# EAGLE design chariot_power (EAGLE 9.2.2)
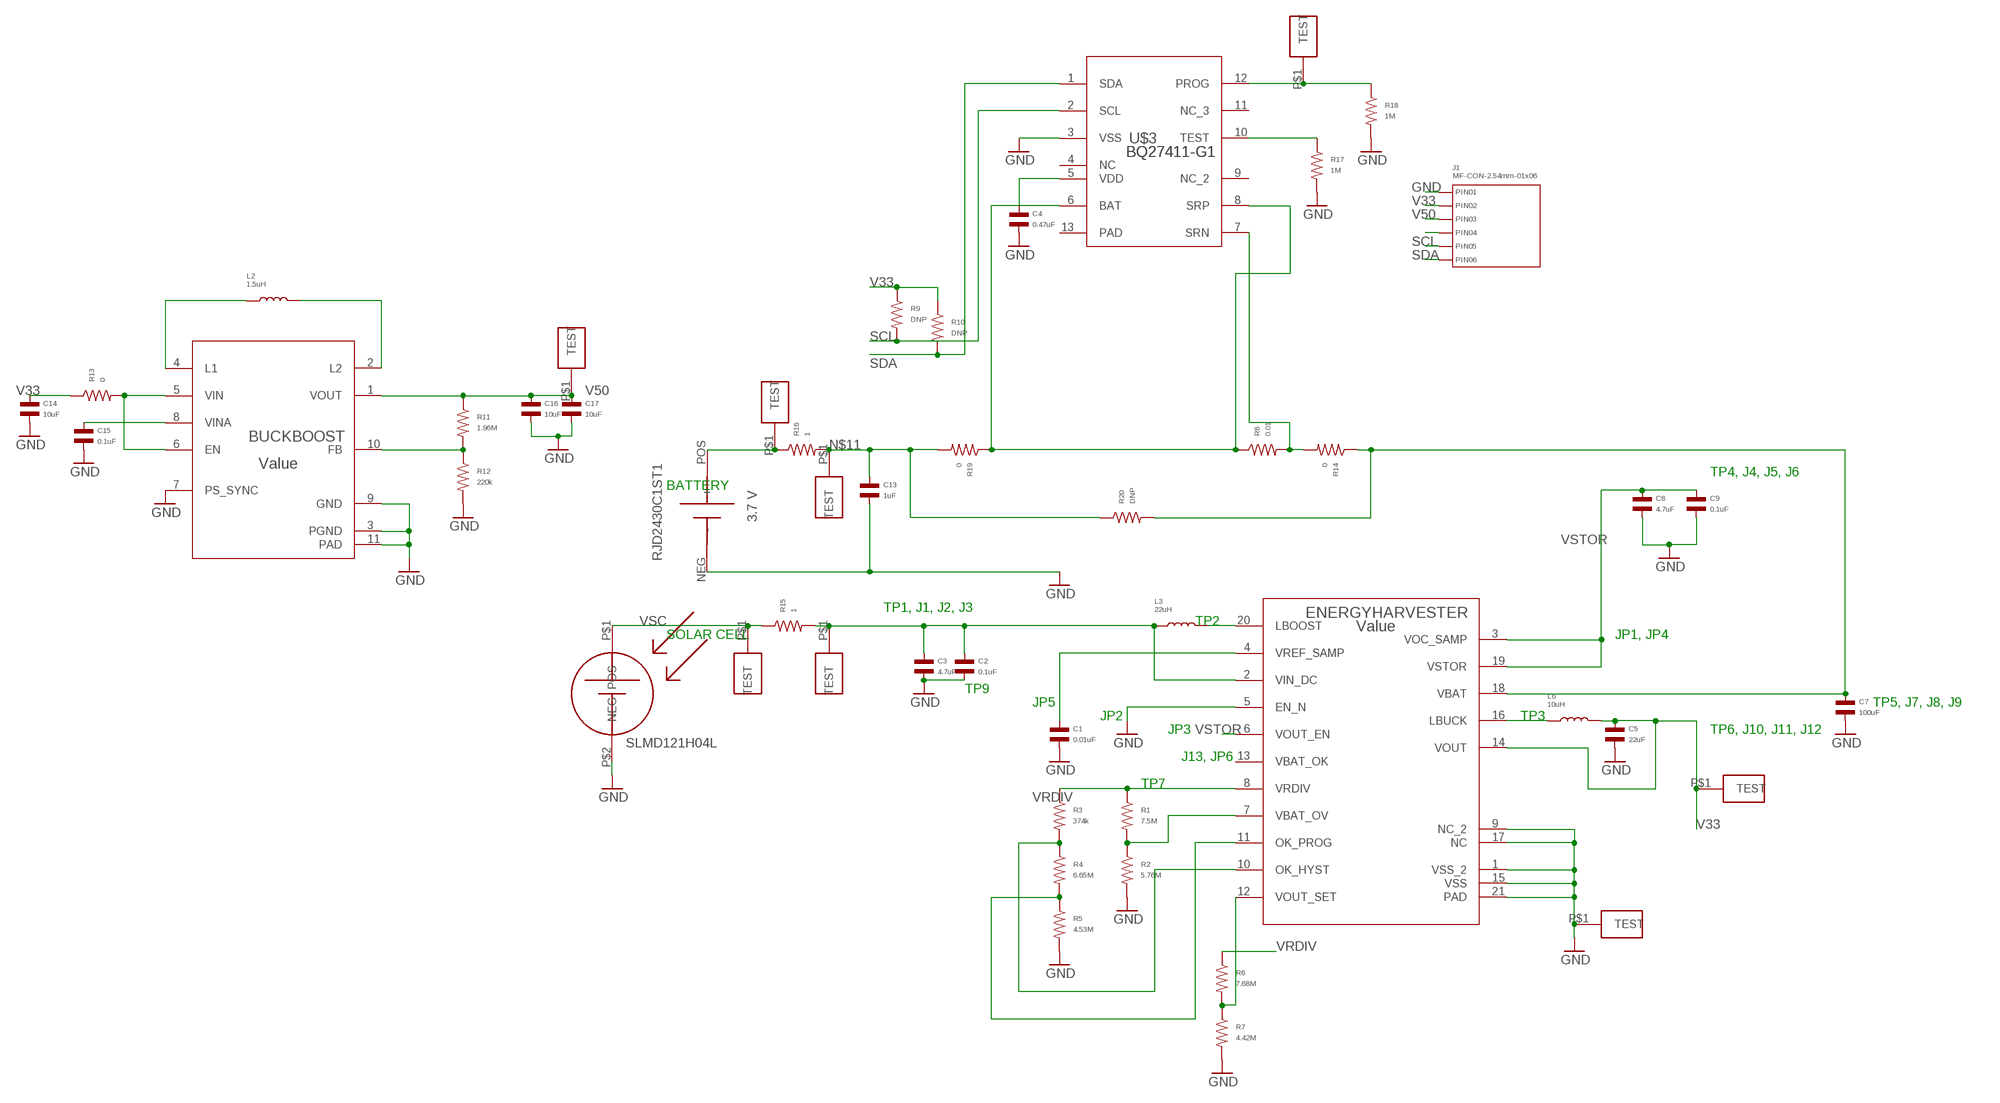
[diagram p0: schematic, sheet 1]

## Parts
BUCKBOOST  Value  TPS63030DSKR  [DSK0010A]
C1  0.01uF  CAPACITOR_NP_0603  [C0603]
C2  0.1uF  CAPACITOR_NP_0603  [C0603]
C3  4.7uF  CAPACITOR_NP_0603  [C0603]
C4  0.47uF  CAPACITOR_NP_0603  [C0603]
C5  22uF  CAPACITOR_NP_0603  [C0603]
C7  100uF  CAPACITOR_NP_0603  [C0603]
C8  4.7uF  CAPACITOR_NP_0603  [C0603]
C9  0.1uF  CAPACITOR_NP_0603  [C0603]
C13  1uF  CAPACITOR_NP_0603  [C0603]
C14  10uF  CAPACITOR_NP_0603  [C0603]
C15  0.1uF  CAPACITOR_NP_0603  [C0603]
C16  10uF  CAPACITOR_NP_0603  [C0603]
C17  10uF  CAPACITOR_NP_0603  [C0603]
ENERGYHARVESTER  Value  BQ25570RGRR  [RGR0020A]
J1  MF-CON-2.54mm-01x06  CON_01X06_PTH_2.54MM  [PTH_2.54MM_01X06]
L2  1.5uH  INDUCTOR_0603  [L0603]
L3  22uH  INDUCTOR_0603  [L0603]
L6  10uH  INDUCTOR_0603  [L0603]
R1  7.5M  RESISTOR_0603  [R0603]
R2  5.76M  RESISTOR_0603  [R0603]
R3  374k  RESISTOR_0603  [R0603]
R4  6.65M  RESISTOR_0603  [R0603]
R5  4.53M  RESISTOR_0603  [R0603]
R6  7.68M  RESISTOR_0603  [R0603]
R7  4.42M  RESISTOR_0603  [R0603]
R8  0.01  RESISTOR_0603  [R0603]
R9  DNP  RESISTOR_0603  [R0603]
R10  DNP  RESISTOR_0603  [R0603]
R11  1.96M  RESISTOR_0603  [R0603]
R12  220k  RESISTOR_0603  [R0603]
R13  0  RESISTOR_0603  [R0603]
R14  0  RESISTOR_0603  [R0603]
R15  1  RESISTOR_0603  [R0603]
R16  1  RESISTOR_0603  [R0603]
R17  1M  RESISTOR_0603  [R0603]
R18  1M  RESISTOR_0603  [R0603]
R19  0  RESISTOR_0603  [R0603]
R20  DNP  RESISTOR_0603  [R0603]
TP1  TESTPOINT_LOOP  [TESTPOINT_LOOP]
TP2  TESTPOINT_LOOP  [TESTPOINT_LOOP]
TP3  TESTPOINT_LOOP  [TESTPOINT_LOOP]
TP4  TESTPOINT_LOOP  [TESTPOINT_LOOP]
TP5  TESTPOINT_LOOP  [TESTPOINT_LOOP]
TP6  TESTPOINT_LOOP  [TESTPOINT_LOOP]
TP7  TESTPOINT_LOOP  [TESTPOINT_LOOP]
TP8  TESTPOINT_LOOP  [TESTPOINT_LOOP]
U$1  SLMD121H04L  [SLMD121H04L]
U$2  RJD2430C1ST1.  [RJD2430C1ST1]
U$3  BQ27411-G1  [DRZ0012A]

## Nets
EXT_VCC: J1.P$4(PIN4)
GND: BUCKBOOST.3(PGND) BUCKBOOST.7(PS_SYNC) BUCKBOOST.9(GND) BUCKBOOST.11(PAD) C1.P$2 C2.P$2 C3.P$2 C4.P$2 C5.P$2 C7.P$2 C8.P$2 C9.P$2 C13.P$2 C14.P$2 C15.P$2 C16.P$2 C17.P$2 ENERGYHARVESTER.1(VSS_2) ENERGYHARVESTER.5(EN_N) ENERGYHARVESTER.9(NC_2) ENERGYHARVESTER.15(VSS) ENERGYHARVESTER.17(NC) ENERGYHARVESTER.21(PAD) J1.P$1(PIN1) R2.P$2 R5.P$2 R7.P$2 R12.P$2 R17.P$2 R18.P$2 TP1.P$1(TEST) U$1.P$2(NEG) U$2.NEG(-) U$3.3(VSS)
N$1: C1.P$1 ENERGYHARVESTER.4(VREF_SAMP)
N$2: ENERGYHARVESTER.20(LBOOST) L3.P$2
N$3: C7.P$1 ENERGYHARVESTER.18(VBAT) R14.P$1 R20.P$2
N$4: ENERGYHARVESTER.16(LBUCK) L6.P$1
N$5: C14.P$1 R13.P$1
N$6: ENERGYHARVESTER.7(VBAT_OV) R1.P$2 R2.P$1
N$7: ENERGYHARVESTER.12(VOUT_SET) R6.P$2 R7.P$1
N$8: R17.P$1 U$3.10(TEST)
N$9: ENERGYHARVESTER.10(OK_HYST) R3.P$2 R4.P$1
N$10: ENERGYHARVESTER.11(OK_PROG) R4.P$2 R5.P$1
N$11: C13.P$1 R16.P$2 R19.P$2 R20.P$1 TP7.P$1(TEST)
N$12: BUCKBOOST.4(L1) L2.P$1
N$13: R8.P$2 R14.P$2 U$3.7(SRN)
N$14: R18.P$1 TP8.P$1(TEST) U$3.12(PROG)
N$15: C4.P$1 U$3.5(VDD)
N$16: BUCKBOOST.2(L2) L2.P$2
N$18: BUCKBOOST.8(VINA) C15.P$1
N$20: BUCKBOOST.10(FB) R11.P$2 R12.P$1
SCL: J1.P$5(PIN5) R9.P$2 U$3.2(SCL)
SDA: J1.P$6(PIN6) R10.P$2 U$3.1(SDA)
V33: BUCKBOOST.5(VIN) BUCKBOOST.6(EN) C5.P$1 ENERGYHARVESTER.14(VOUT) J1.P$2(PIN2) L6.P$2 R9.P$1 R10.P$1 R13.P$2 TP2.P$1(TEST)
V50: BUCKBOOST.1(VOUT) C16.P$1 C17.P$1 J1.P$3(PIN3) R11.P$1 TP3.P$1(TEST)
VBAT: R16.P$1 TP5.P$1(TEST) U$2.POS(+)
VBAT2: R8.P$1 R19.P$1 U$3.6(BAT) U$3.8(SRP)
VIN1: C2.P$1 C3.P$1 ENERGYHARVESTER.2(VIN_DC) L3.P$1 R15.P$2 TP6.P$1(TEST)
VRDIV: ENERGYHARVESTER.8(VRDIV) R1.P$1 R3.P$1 R6.P$1
VSC: R15.P$1 TP4.P$1(TEST) U$1.P$1(POS)
VSTOR: C8.P$1 C9.P$1 ENERGYHARVESTER.3(VOC_SAMP) ENERGYHARVESTER.6(VOUT_EN) ENERGYHARVESTER.19(VSTOR)
Unconnected: ENERGYHARVESTER.13(VBAT_OK) U$3.4(NC) U$3.9(NC_2) U$3.11(NC_3) U$3.13(PAD)

## Notes on the sheet
- TP4, J4, J5, J6
- BATTERY
- TP1, J1, J2, J3
- TP2
- SOLAR CELL | JP1, JP4
- TP9
- JP5 | TP5, J7, J8, J9
- JP2 | TP3
- JP3 | TP6, J10, J11, J12
- J13, JP6
- TP7

## Library data of the parts
BUCKBOOST = CharIoT:TPS63030DSKR; COMPTYPE: IC; MANUFACTURER: Texas Instruments; MOUNTTYPE: SMT; PACKAGEREFERENCE: DSK0010A; PARTNUMBER: TPS63030DSK; PIN_COUNT: 11; REFDES: RefDes; ROHS: Y; TYPE: TYPE
C1-C5 C7-C9 C13-C17 = MF_Passives:CAPACITOR_NP: Library: MF_Passives Description: Device for Non-Polarized Capacitors. Manufacture part number (MPN) can be added via Attributes. Check https://factory.macrofab.com/parts for the house parts list.; POPULATE: 1
ENERGYHARVESTER = CharIoT:BQ25570RGRR: EVM; ALTERNATEPARTNUMBER: BQ25570RGRT; APPLICATION_BUILDNUMBER: *; COMPTYPE: IC; MANUFACTURER: Texas Instruments; MOUNTTYPE: SMT; PACKAGEREFERENCE: RGR0020A; PARTNUMBER: BQ25570RGRR; PIN_COUNT: 21; REFDES: RefDes; ROHS: Y; TYPE: TYPE
J1 = MF_Connectors:CON_01X06: Library: MF_Connectors Description: Header Connector with 6 Positions and 01 Rows. Use the LABEL Attribute to label the pin on the schematic and PCB. You can remove the attributes on the PCB by using the SMASH function on the part and then deleting the text.; HOUSEPART: YES; MPN: MF-CON-2.54mm-01x06; POPULATE: 1; URL: https://factory.macrofab.com/part/MF-CON-2.54mm-01x06
L2 L3 L6 = MF_Passives:INDUCTOR: Library: MF_Passives Description: Device for Inductors. Manufacture part number (MPN) can be added via Attributes. Check https://factory.macrofab.com/parts for the house parts list.; POPULATE: 1
R1-R20 = MF_Passives:RESISTOR: Library: MF_Passives Description: Device for Resistors. Manufacture part number (MPN), Voltage, Tolerance, and Wattage Rating can be added via Attributes. Check https://factory.macrofab.com/parts for the house parts list.; POPULATE: 1
TP1-TP8 = CharIoT:TESTPOINT_LOOP
U$1 = CharIoT:SLMD121H04L: Solar Cell
U$2 = CharIoT:RJD2430C1ST1.: Battery
U$3 = CharIoT:BQ27411-G1: New Fuel Gauge

## Board
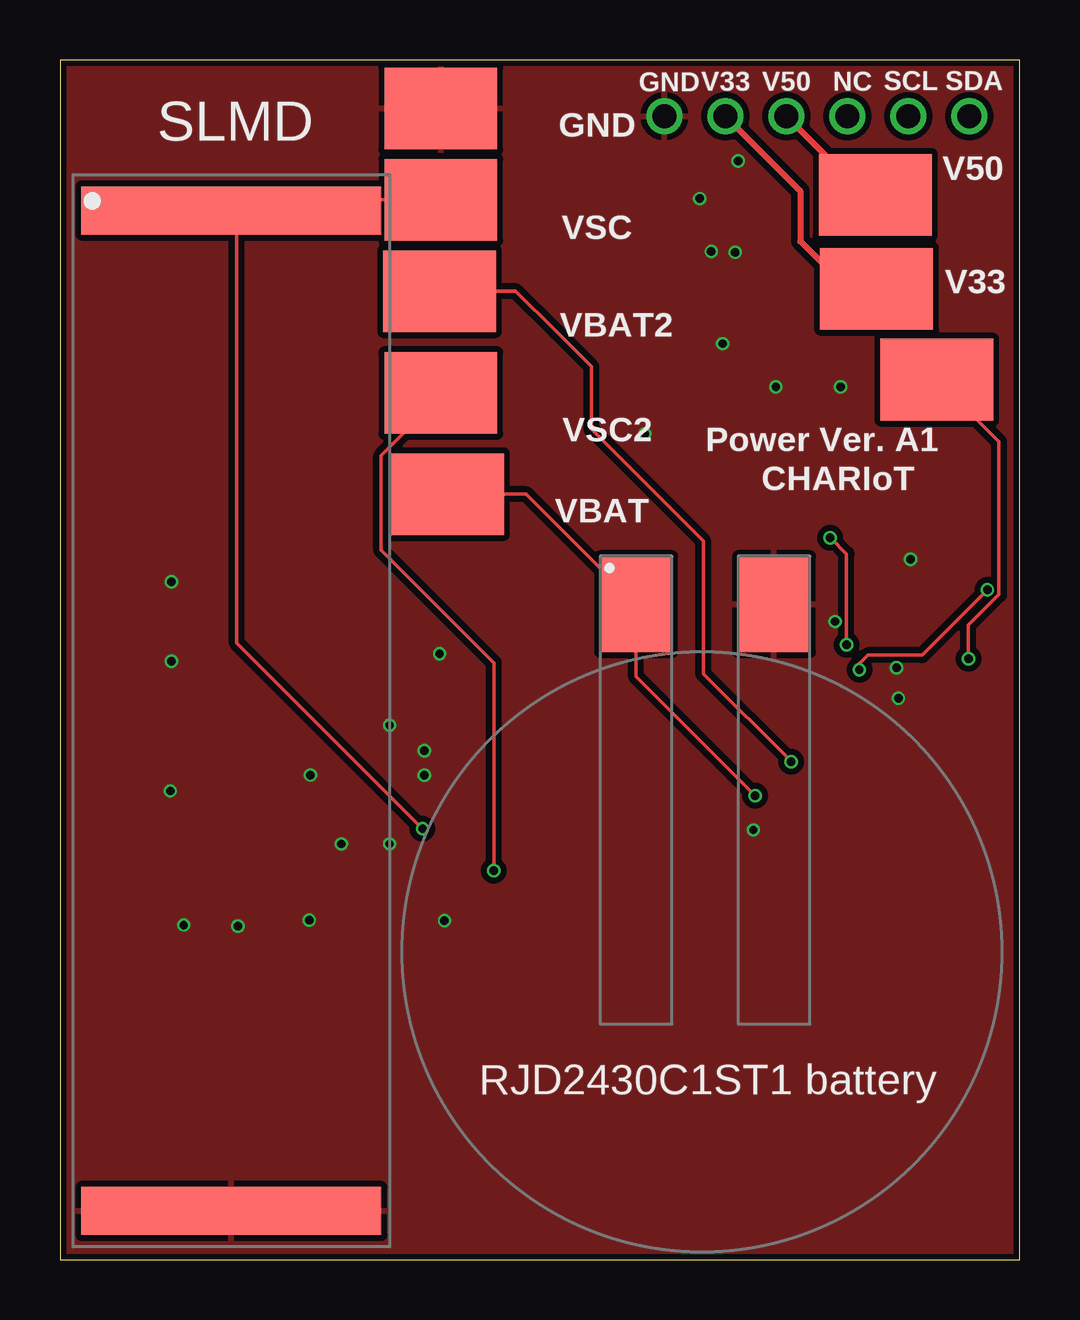
[diagram p1: board, top side]
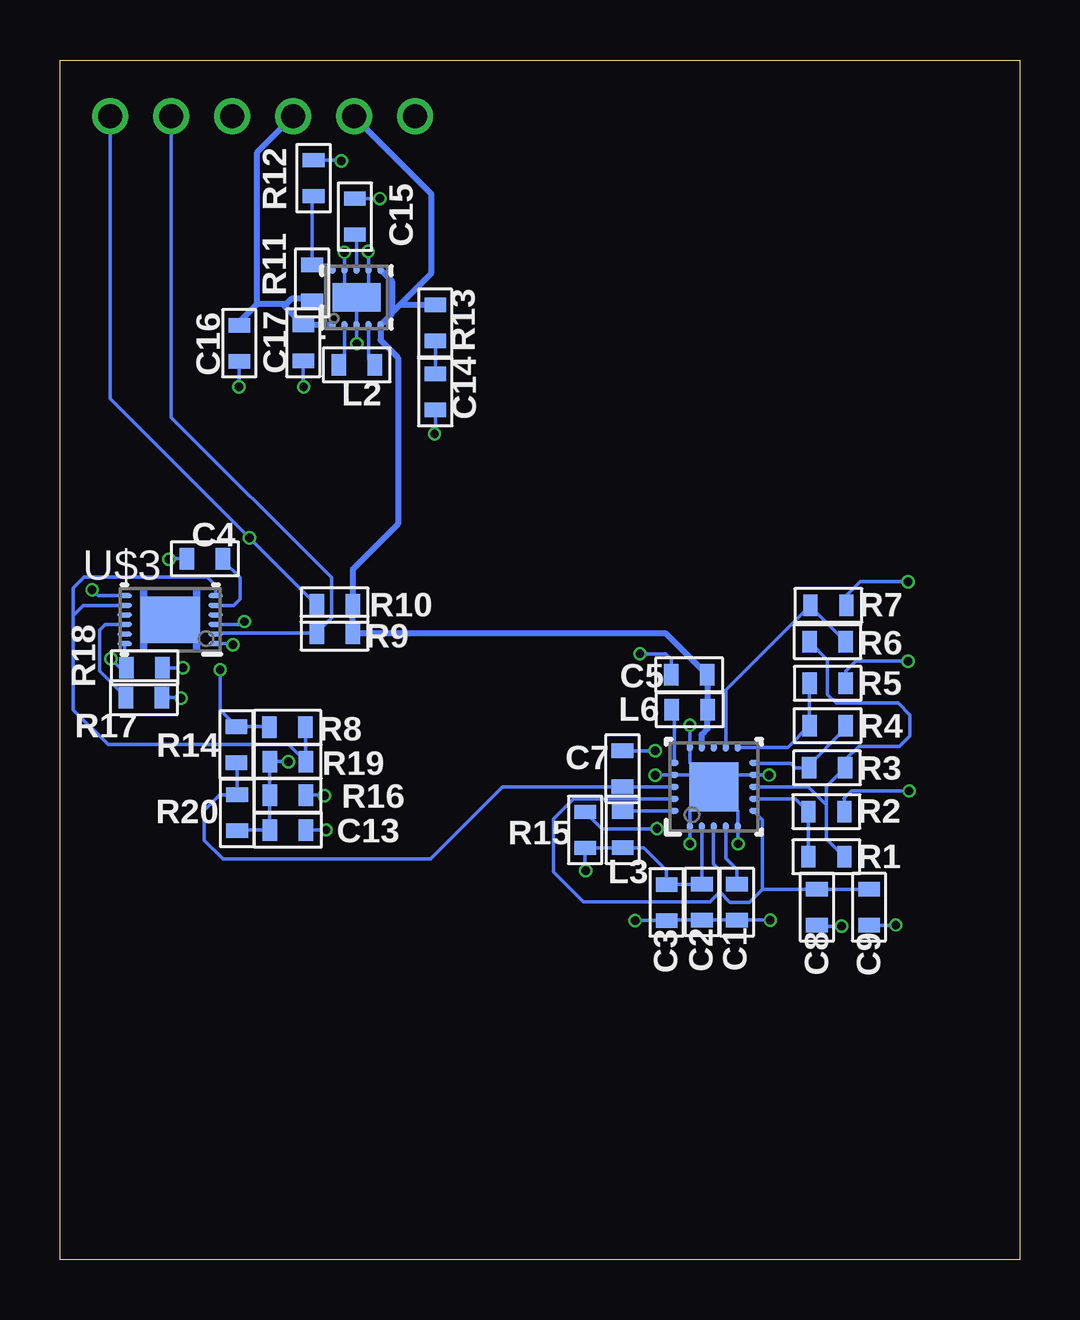
[diagram p2: board, bottom side, seen from below]

Size 40 x 50 mm. Coordinates in mm from the lower left corner, seen from the top.
Outline: 0,0 40,0 40,50 0,50 0,0
Copper layers (1*16): Top 0.035mm / dielectric 1.5mm / Bottom 0.035mm
Design rules "MF_Standard_2_Layer *": minimum track width 5mil, minimum drill 10mil, track to track 5mil, track to pad 5mil, pad to pad 5mil, via to via 5mil, smd to smd 0mil, copper to edge 10mil, drill to drill 10mil, minimum pad ring 4mil, minimum via ring 4mil, stop-mask expansion 2mil, vias tented up to drill 25mil, thermal gap 10mil

### Footprints (pad centres in the part's own frame; a part is rotated, then mirrored left to right if it is on the bottom)
DSK0010A = smd 0.35 x 0.25: 1 -1.15,1; 2 -1.15,0.5; 3 -1.15,0; 4 -1.15,-0.5; 5 -1.15,-1; 6 1.15,-1; 7 1.15,-0.5; 8 1.15,0; 9 1.15,0.5; 10 1.15,1 | smd 1.2 x 2: 11 0,0 | smd 0.5 x 0.5: V 0,-0.394
C0603 = smd 0.6 x 0.9: P$1 -0.75,0; P$2 0.75,0
RGR0020A = smd 0.36 x 0.24: 1 -1.65,1; 2 -1.65,0.5; 3 -1.65,0; 4 -1.65,-0.5; 5 -1.65,-1; 11 1.65,-1; 12 1.65,-0.5; 13 1.65,0; 14 1.65,0.5; 15 1.65,1 | smd 0.24 x 0.36: 6 -1,-1.65; 7 -0.5,-1.65; 8 0,-1.65; 9 0.5,-1.65; 10 1,-1.65; 16 1,1.65; 17 0.5,1.65; 18 0,1.65; 19 -0.5,1.65; 20 -1,1.65 | smd 2.05 x 2.05: 21 0,0 | smd 0.5 x 0.5: V 0,-0.775
PTH_2.54MM_01X06 = drill 1: P$1 -6.35,0; P$2 -3.81,0; P$3 -1.27,0; P$4 1.27,0; P$5 3.81,0; P$6 6.35,0
L0603 = smd 0.6 x 0.9: P$1 -0.75,0; P$2 0.75,0
R0603 = smd 0.6 x 0.9: P$1 -0.75,0; P$2 0.75,0
TESTPOINT_LOOP = smd 4.7 x 3.4: P$1 0,0
SLMD121H04L = smd 12.5 x 2: P$1 0,0; P$2 0,-41.7
RJD2430C1ST1 = smd 3 x 4: NEG 3,14.5; POS -2.75,14.5
DRZ0012A = smd 0.6 x 0.2: 1 -1.9,1; 2 -1.9,0.6; 3 -1.9,0.2; 4 -1.9,-0.2; 5 -1.9,-0.6; 6 -1.9,-1; 7 1.9,-1; 8 1.9,-0.6; 9 1.9,-0.2; 10 1.9,0.2; 11 1.9,0.6; 12 1.9,1 | smd 2.45 x 1.95: 13 0,0 | smd 0.5 x 0.5: V 0,-0.725

### Placement (x,y rotation side)
BUCKBOOST  27.64,40.1 90 bottom
C1  11.78,14.9 270 bottom
C2  13.24,14.9 270 bottom
C3  14.71,14.88 270 bottom
C4  33.96,29.21 180 bottom
C5  13.77,24.37 180 bottom
C7  16.55,20.46 90 bottom
C8  8.45,14.69 270 bottom
C9  6.28,14.69 270 bottom
C13  30.5,17.9 0 bottom
C14  24.35,36.16 270 bottom
C15  27.71,43.47 90 bottom
C16  32.52,38.19 270 bottom
C17  29.86,38.21 270 bottom
ENERGYHARVESTER  12.74,19.7 90 bottom
J1  31.55,47.65 0 top
L2  27.63,37.29 180 bottom
L3  16.55,17.91 90 bottom
L6  13.75,22.91 0 bottom
R1  8.05,16.79 180 bottom
R2  8.05,18.67 0 bottom
R3  8.03,20.5 180 bottom
R4  8,22.26 180 bottom
R5  7.99,24.02 0 bottom
R6  8,25.75 0 bottom
R7  7.97,27.27 0 bottom
R8  30.52,22.18 180 bottom
R9  28.55,26.11 180 bottom
R10  28.55,27.28 180 bottom
R11  29.49,40.71 90 bottom
R12  29.43,45.07 90 bottom
R13  24.36,39.04 90 bottom
R14  32.64,21.46 90 bottom
R15  18.11,17.91 270 bottom
R16  30.51,19.35 180 bottom
R17  36.5,23.42 0 bottom
R18  36.47,24.66 0 bottom
R19  30.51,20.75 180 bottom
R20  32.61,18.62 90 bottom
TP1  15.88,47.98 0 top
TP2  34.04,40.46 0 top
TP3  33.99,44.37 0 top
TP4  15.88,44.17 0 top
TP5  16.15,31.9 0 top
TP6  15.88,36.12 0 top
TP7  15.82,40.36 0 top
TP8  36.55,36.68 0 top
U$1  7.14,43.73 0 top
U$2  26.76,12.82 0 top
U$3  35.41,26.67 180 bottom

### Tracks (layer width: path | path; a pad name or v marks a point on that pad's centre or on a via)
GND  (via drill 0.35)
  Bottom 0.152: R2.P$2 7.3,19.21 7.32,19.23 7.01,19.53 v4.6,19.53 | R5.P$2 7.25,24.53 6.83,24.94 v4.65,24.94 | ENERGYHARVESTER.21 11.74,18.7 ENERGYHARVESTER.5 v11.74,17.33 v11.73,17.32 | ENERGYHARVESTER.21 13.74,18.7 ENERGYHARVESTER.1 v13.74,17.32 | ENERGYHARVESTER.21 13.24,20.2 ENERGYHARVESTER.17 15.18,20.2 v15.19,20.19 | ENERGYHARVESTER.21 13.74,20.7 ENERGYHARVESTER.15 v13.74,22.27 v13.74,22.28 | ENERGYHARVESTER.21 12.24,20.2 ENERGYHARVESTER.9 v10.45,20.2 v10.44,20.2 | v13.74,17.32 | R7.P$2 7.22,27.68 6.63,28.27 4.67,28.27 v4.65,28.25 | v16.03,14.12 16.02,14.13 C3.P$2 14.69,14.15 C2.P$2 C1.P$2 v10.39,14.15 | C7.P$2 v15.19,21.21 | C5.P$2 14.52,25.04 14.73,25.25 v15.82,25.25 | C9.P$2 v5.16,13.94 v5.16,13.95 | C8.P$2 8.41,13.89 v7.42,13.89 | C13.P$2 28.91,17.9 v28.91,17.91 | v27.62,38.18 27.64,38.2 BUCKBOOST.3 27.64,39.86 27.7,39.91 27.7,40.08 | v27.15,42.02 27.14,42 BUCKBOOST.7 27.14,40.66 27.25,40.56 27.43,40.56 27.7,40.29 27.7,40.16 | v28.14,41.99 v28.14,41.98 BUCKBOOST.9 28.14,40.6 27.7,40.16 | C15.P$2 v26.67,44.22 | C17.P$2 29.86,36.38 v29.84,36.37 | C16.P$2 32.52,36.38 v32.54,36.37 | R12.P$2 28.3,45.82 v28.27,45.8 | C14.P$2 24.35,34.45 v24.38,34.42 | R17.P$2 34.98,23.42 v34.95,23.39 | R18.P$2 v34.87,24.66 | U$3.3 32.43,26.47 v32.31,26.59 | C4.P$2 35.43,29.21 v35.46,29.18 | 27.7,40.08 27.7,40.16 | 27.7,40.16 BUCKBOOST.11 27.68,40.1 27.7,40.08
  Bottom 0.254: C9.P$2
  pour Top (isolate 0.254): 0,50.04 0,0 40.01,0 40.01,50.04
N$1
  Bottom 0.152: C1.P$1 11.78,16.25 12.24,16.71 ENERGYHARVESTER.4
N$2
  Bottom 0.152: ENERGYHARVESTER.20 16.51,18.7 L3.P$2
N$3
  Bottom 0.152: ENERGYHARVESTER.18 C7.P$1 21.54,19.71 24.56,16.69 33.2,16.69 33.98,17.48 33.98,18.72 33.34,19.37 R20.P$2 32.61,20.69 R14.P$1
N$4
  Bottom 0.152: ENERGYHARVESTER.16 14.39,22.8 L6.P$1
N$5
  Bottom 0.152: C14.P$1 R13.P$1
N$6
  Bottom 0.152: ENERGYHARVESTER.7 9.34,19.2 R2.P$1 R1.P$2
N$7
  Bottom 0.152: ENERGYHARVESTER.12 12.24,23.74 8.77,27.21 8.72,27.21 | R6.P$2 8.72,27.21 | 8.72,27.21 R7.P$1
N$8
  Bottom 0.152: R17.P$1 38.35,24.52 38.35,26.24 38.12,26.47 U$3.10
N$9
  Bottom 0.152: R3.P$2 8.89,20.5 | 8.89,20.5 9.35,20.5 9.53,20.68 11.06,20.68 ENERGYHARVESTER.10 | R4.P$1 7.25,22.14 8.89,20.5
N$10
  Bottom 0.152: ENERGYHARVESTER.11 9.65,21.35 R4.P$2 R5.P$1
N$11  (via drill 0.35)
  Top 0.152: v30.48,20.75 26.82,24.41 26.82,29.95 22.15,34.62 22.15,37.21 20.71,38.65 20.65,38.71 19,40.36 TP7.P$1
  Bottom 0.152: R20.P$1 32.58,17.9 C13.P$1 R16.P$2 R19.P$2 v30.48,20.75
N$12
  Bottom 0.152: L2.P$1 27.14,37.55 BUCKBOOST.4
N$13  (via drill 0.35)
  Top 0.152: v38.66,27.91 35.94,25.2 33.68,25.2 33.33,24.84 v33.33,24.59
  Bottom 0.152: R8.P$2 31.29,22.21 R14.P$2 33.33,22.9 v33.33,24.59 | U$3.7 38.41,27.67 v38.66,27.91
N$14  (via drill 0.35)
  Top 0.152: v37.87,25.04 37.87,26.45 39.14,27.72 39.14,34.09 TP8.P$1
  Bottom 0.152: U$3.12 37.31,24.75 R18.P$1 37.49,24.66 v37.87,25.04
N$15
  Bottom 0.152: U$3.5 32.78,27.27 32.77,27.25 32.49,27.53 32.49,28.42 33.21,29.15 C4.P$1
N$16
  Bottom 0.152: L2.P$2 28.14,37.53 BUCKBOOST.2
N$18
  Bottom 0.152: BUCKBOOST.8 27.64,42.65 C15.P$1
N$20
  Bottom 0.152: BUCKBOOST.10 28.84,41.46 R11.P$2 29.49,44.26 R12.P$1
SCL
  Bottom 0.152: U$3.2 33.47,26.11 R9.P$2 28.68,26.73 28.68,28.42 35.36,35.1 J1.P$5
SDA  (via drill 0.35)
  Top 0.152: v32.79,25.63 32.79,29.41 32.12,30.08 v32.1,30.08
  Bottom 0.152: R10.P$2 v32.1,30.08 37.9,35.88 J1.P$6 | U$3.1 32.83,25.67 v32.79,25.63
V33
  Top 0.254: J1.P$2 30.86,44.53 30.86,42.44 32.84,40.46 TP2.P$1
  Bottom 0.152: 26.16,39.47 26.16,39.43 25.8,39.79 | 26.64,38.33 | 13.02,22.93 L6.P$2
  Bottom 0.254: ENERGYHARVESTER.14 13.24,21.89 13,22.12 L6.P$2 | BUCKBOOST.6 26.16,40.77 26.16,39.47 24.51,41.12 24.51,44.4 27.74,47.63 J1.P$2 | 26.16,39.43 BUCKBOOST.5 26.64,38.33 | 26.64,38.33 25.91,37.59 25.91,30.66 27.8,28.77 R10.P$1 R9.P$1 14.76,26.11 C5.P$1 13.02,22.93 | R13.P$2 25.8,39.79
V50
  Top 0.254: TP3.P$1 33.56,44.37 J1.P$3
  Bottom 0.152: C17.P$1 | 32.52,39.08 C16.P$1 | R11.P$1 29.58,40.05
  Bottom 0.254: BUCKBOOST.1 C17.P$1 | C17.P$1 30.65,39.75 30.57,39.83 | 30.57,39.83 31.77,39.83 | 31.77,39.83 32.52,39.08 | 30.57,39.83 30.35,40.05 29.58,40.05 | 31.77,39.83 31.77,46.16 J1.P$3
VBAT  (via drill 0.35)
  Top 0.152: v28.98,19.33 24.01,24.3 U$2.POS 21.17,30.16 21.13,30.2 19.43,31.9 TP5.P$1
  Bottom 0.152: R16.P$1 29.01,19.36 v28.98,19.33
VBAT2
  Bottom 0.152: R8.P$1 29.77,20.76 R19.P$1 30.47,21.46 38,21.46 39.45,22.91 39.45,26.85 | 39.45,26.85 39.02,27.27 U$3.8 | U$3.6 33.51,28.1 33.86,28.45 38.99,28.45 39.45,27.99 39.45,26.85
VIN1  (via drill 0.35)
  Top 0.152: v18.09,16.2 18.09,24.87 13.39,29.57 13.39,33.5 15.88,35.99 TP6.P$1
  Bottom 0.152: ENERGYHARVESTER.2 C2.P$1 13.26,15.63 C3.P$1 14.71,16.21 15.66,17.16 L3.P$1 R15.P$2 18.11,16.23 v18.09,16.2
VRDIV
  Bottom 0.152: R1.P$1 8.05,17.54 8.05,18.96 | 8.05,18.96 8.8,19.7 ENERGYHARVESTER.8 | 8.05,18.96 8.05,19.72 R3.P$1 7.28,20.82 6.71,21.39 5,21.39 4.57,21.82 4.57,22.71 5.05,23.19 7.64,23.19 8,23.55 8,25 R6.P$1 | R6.P$1
VSC  (via drill 0.35)
  Top 0.152: v15.11,17.96 7.37,25.7 7.37,43.73 U$1.P$1 7.59,44.17 TP4.P$1
  Bottom 0.152: R15.P$1 17.41,17.96 v15.11,17.96
VSTOR
  Bottom 0.152: ENERGYHARVESTER.19 16.02,19.2 17.09,19.2 18.6,19.2 18.76,19.04 18.76,19.03 19.43,18.36 19.43,16.15 18.19,14.91 12.9,14.91 12.5,15.32 | ENERGYHARVESTER.3 12.75,16.48 12.5,16.23 12.5,15.32 | ENERGYHARVESTER.6 10.72,18.33 10.72,15.42 | 10.72,15.42 11.25,14.88 12.06,14.88 12.5,15.32 | C9.P$1 C8.P$1 8.47,15.42 10.72,15.42

### Text on the board
tNames: GND | V33 | V50 | NC | SCL | SDA | GND | V50 | VSC | V33 | VBAT2 | VSC2 | Power Ver. A1 | VBAT | CHARIoT